# EAGLE design ANEMOI_LOG (EAGLE 9.6.2)
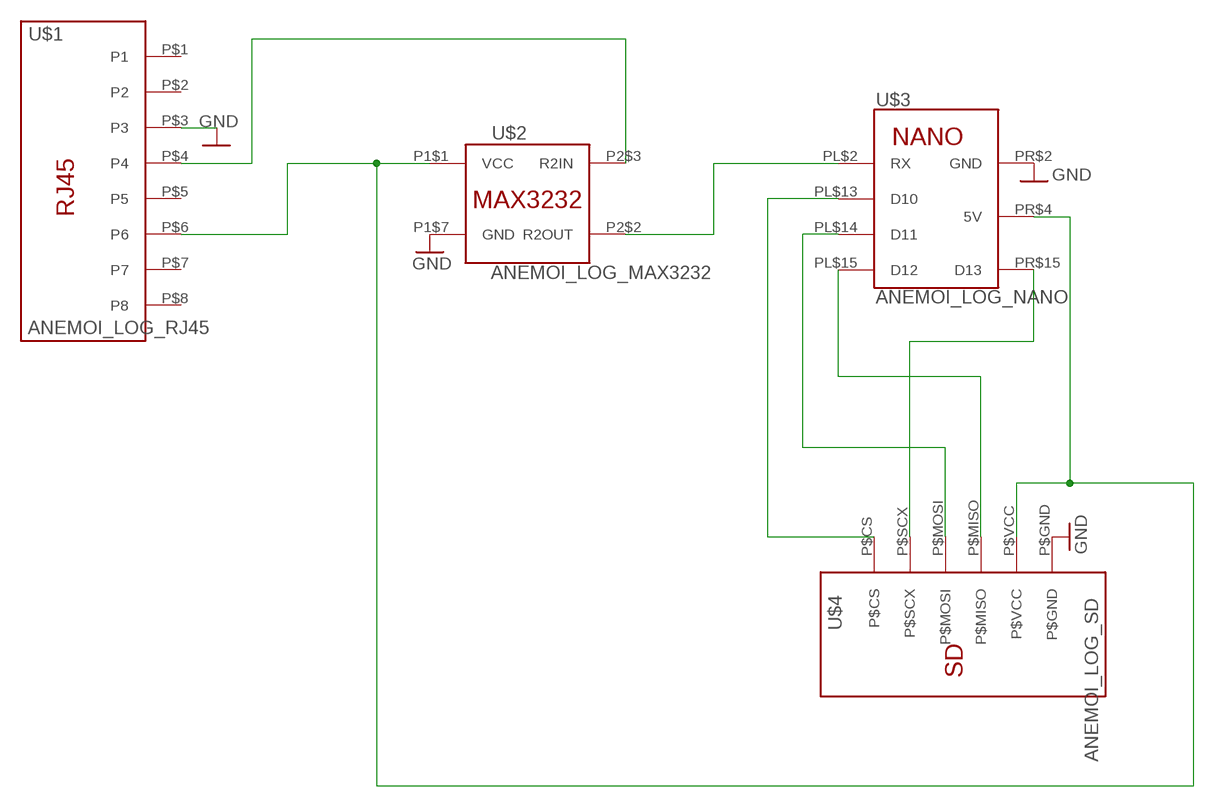
[diagram p0: schematic, sheet 1]

## Parts
U$1  ANEMOI_LOG_RJ45  [ANEMOI_LOG_RJ45]
U$2  ANEMOI_LOG_MAX3232  [ANEMOI_LOG_MAX2323]
U$3  ANEMOI_LOG_NANO  [ANEMOI_LOG_NANO]
U$4  ANEMOI_LOG_SD  [ANEMOI_LOG_SD]

## Nets
5V: U$1.P$6(P6) U$2.P1$1(VCC) U$3.PR$4(5V) U$4.P$VCC
CS: U$3.PL$13(D10) U$4.P$CS
GND: U$1.P$3(P3) U$2.P1$7(GND) U$3.PR$2(GND) U$4.P$GND
MISO: U$3.PL$15(D12) U$4.P$MISO
MOSI: U$3.PL$14(D11) U$4.P$MOSI
RX: U$1.P$4(P4) U$2.P2$3(R2IN)
RX2: U$2.P2$2(R2OUT) U$3.PL$2(RX)
SCX: U$3.PR$15(D13) U$4.P$SCX
Unconnected: U$1.P$1(P1) U$1.P$2(P2) U$1.P$5(P5) U$1.P$7(P7) U$1.P$8(P8)

## Library data of the parts
U$1 = ANEMOI_LOG:ANEMOI_LOG_RJ45
U$2 = ANEMOI_LOG:ANEMOI_LOG_MAX3232
U$3 = ANEMOI_LOG:ANEMOI_LOG_NANO
U$4 = ANEMOI_LOG:ANEMOI_LOG_SD

## Board
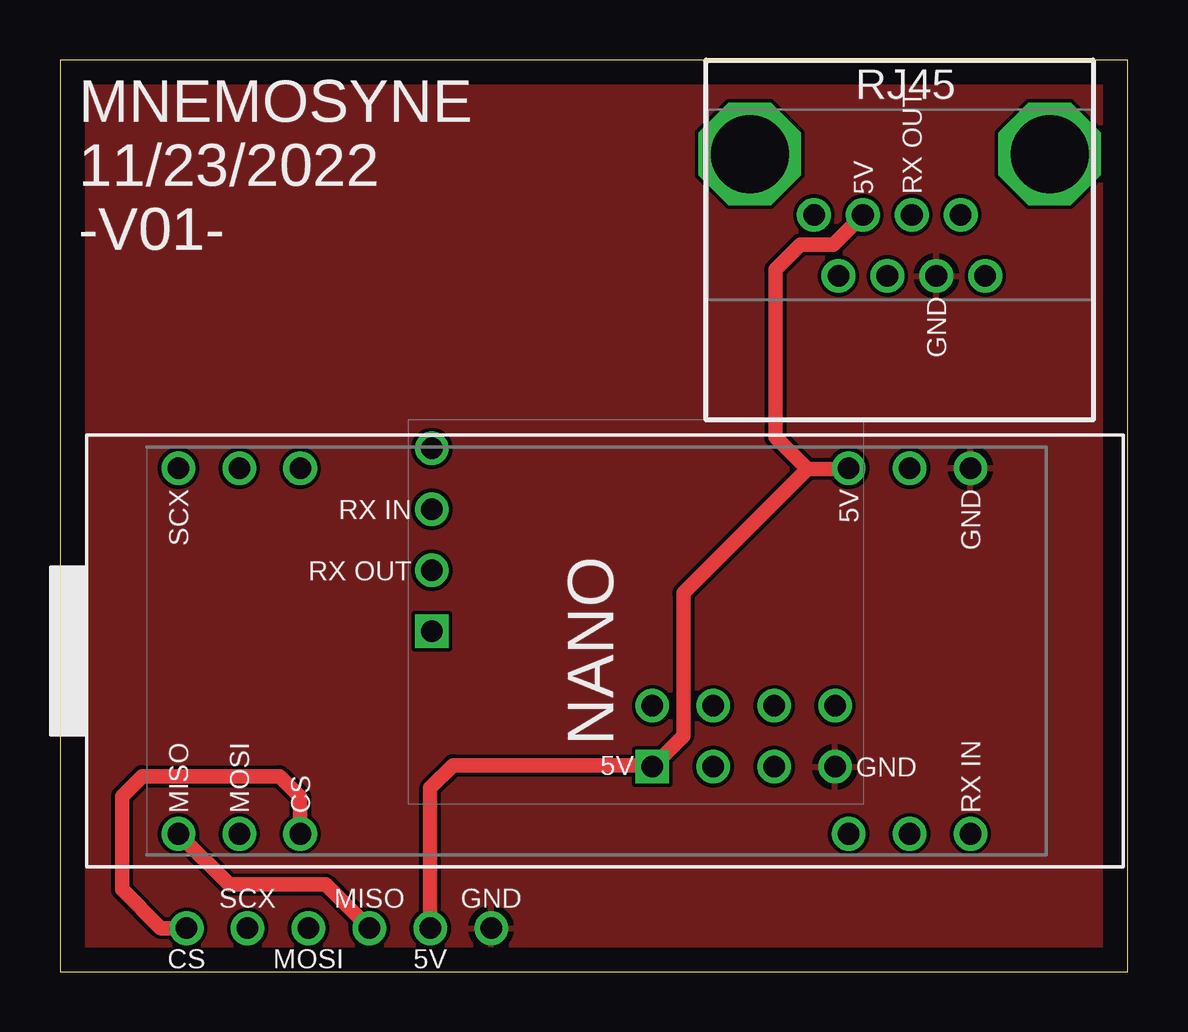
[diagram p1: board, top side]
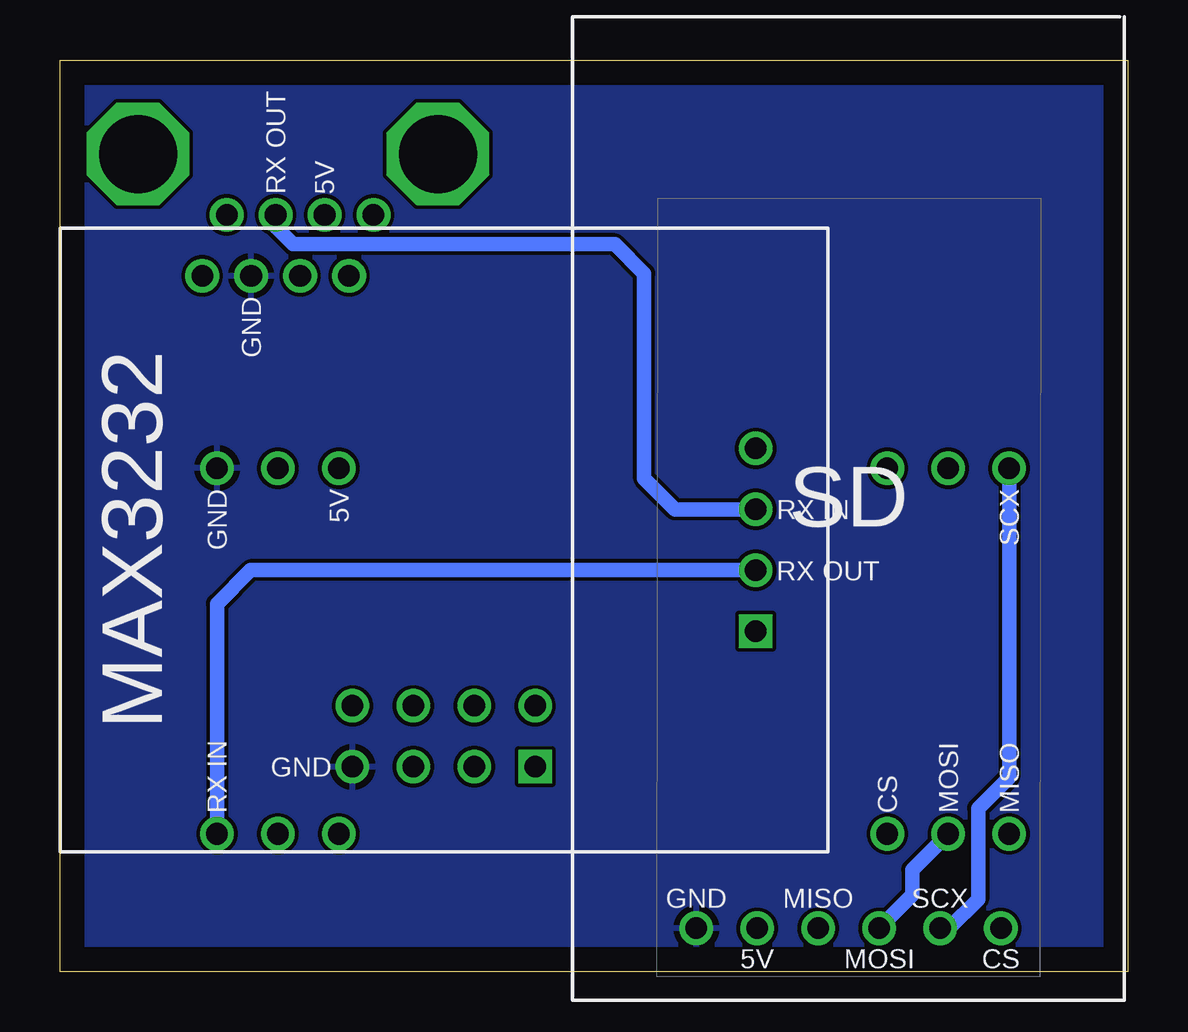
[diagram p2: board, bottom side, seen from below]

Size 44.5 x 38 mm. Coordinates in mm from the lower left corner, seen from the top.
Outline: 0,38 0,0 44.5,0 44.5,38 0,38
Copper layers (1*16): Top 0.035mm / dielectric 1.5mm / Bottom 0.035mm
Design rules "default": minimum track width 6mil, minimum drill 0.35mm, track to track 6mil, track to pad 6mil, pad to pad 6mil, via to via 6mil, smd to smd 6mil, copper to edge 40mil, drill to drill 6mil, minimum pad ring 10mil, minimum via ring 8mil, stop-mask expansion 4mil, vias tented up to drill 0mil, thermal gap 10mil

### Footprints (pad centres in the part's own frame; a part is rotated, then mirrored left to right if it is on the bottom)
ANEMOI_LOG_RJ45 = drill 3.25 pad 3.5 octagon: H1 1.75,3.92; H2 14.25,3.92 | drill 0.9: P$1 4.43,9; P$2 5.45,6.46; P$3 6.47,9; P$4 7.49,6.46; P$5 8.51,9; P$6 9.53,6.46; P$7 10.55,9; P$8 11.57,6.46
ANEMOI_LOG_MAX2323 = drill 0.9 square: P1$1 22.46,-19.81; P2$1 16.81,-29 | drill 0.9: P1$2 19.92,-19.81; P1$3 22.46,-17.27; P1$4 19.92,-17.27; P1$5 22.46,-14.73; P1$6 19.92,-14.73; P1$7 22.46,-12.19; P1$8 19.92,-12.19; P2$2 14.27,-29; P2$3 11.73,-29; P2$4 9.19,-29
ANEMOI_LOG_NANO = drill 0.9: PL$2 7.62,36.84; PL$3 7.62,34.3; PL$4 7.62,31.76; PL$13 7.62,8.9; PL$14 7.62,6.36; PL$15 7.62,3.82; PR$2 -7.62,36.84; PR$3 -7.62,34.3; PR$4 -7.62,31.76; PR$13 -7.62,8.9; PR$14 -7.62,6.36; PR$15 -7.62,3.82
ANEMOI_LOG_SD = drill 0.9: P$CS -6.35,38; P$GND 6.35,38; P$MISO 1.27,38; P$MOSI -1.27,38; P$SCX -3.81,38; P$VCC 3.81,38

### Placement (x,y rotation side)
U$1  43,38 180 top
U$2  44.5,31 270 top
U$3  1.12,13.36 270 top
U$4  11.63,39.8 180 bottom

### Tracks (layer width: path | path; a pad name or v marks a point on that pad's centre or on a via)
5V
  Top 0.61: U$1.P$6 32.24,30.31 30.86,30.31 29.81,29.26 29.81,22.28 31.15,20.94 | 31.15,20.94 32.84,20.94 U$3.PR$4 | 31.15,20.94 25.99,15.78 25.99,9.83 U$2.P1$1 | U$2.P1$1 | U$4.P$VCC 15.44,7.65 16.38,8.6 24.64,8.6 U$2.P1$1
CS
  Top 0.61: U$4.P$CS 4.21,1.8 2.59,3.42 2.59,7.31 3.42,8.14 9.15,8.14 10.02,7.27 U$3.PL$13
GND
  pour Top: 0,0 0,38 44.5,38 44.5,0
  pour Bottom: 44.5,0 44.5,38 0,38 0,0
MISO
  Top 0.61: U$3.PL$15 7.05,3.63 11.07,3.63 U$4.P$MISO
MOSI
  Bottom 0.61: U$3.PL$14 8.97,4.25 8.97,3.19 U$4.P$MOSI
RX
  Bottom 0.61: U$2.P2$3 18.87,19.27 20.15,20.55 20.15,29.1 21.37,30.32 34.78,30.32 35.51,31.04 U$1.P$4
RX2
  Bottom 0.61: U$2.P2$2 36.55,16.73 37.96,15.32 U$3.PL$2
SCX
  Bottom 0.61: U$3.PR$15 4.94,8.1 6.22,6.81 6.22,3.02 7.44,1.8 U$4.P$SCX

### Text on the board
tPlace: 5V | RX OUT | MNEMOSYNE / 11/23/2022 / -V01- | GND | SCX | 5V | GND | RX IN | RX OUT | 5V | GND | MISO | MOSI | CS | RX IN | SCX | MISO | GND | CS | MOSI | 5V
bPlace: 5V | RX OUT | GND | SCX | 5V | GND | RX IN | RX OUT | GND | MISO | MOSI | CS | RX IN | SCX | MISO | GND | CS | MOSI | 5V